# EasyEDA Pro project ProPrj_IP6829Test_2025-08-12.epro

# Schematic Schematic2
Board Name: IP6826; Create Date: 2025-07-03; Page Name: P1; Project Name: IP6829Test; Schematic Name: Schematic2; Update Date: 2025-07-26; Company: 嘉立创EDA; Page Size: A4; Version: V1.0
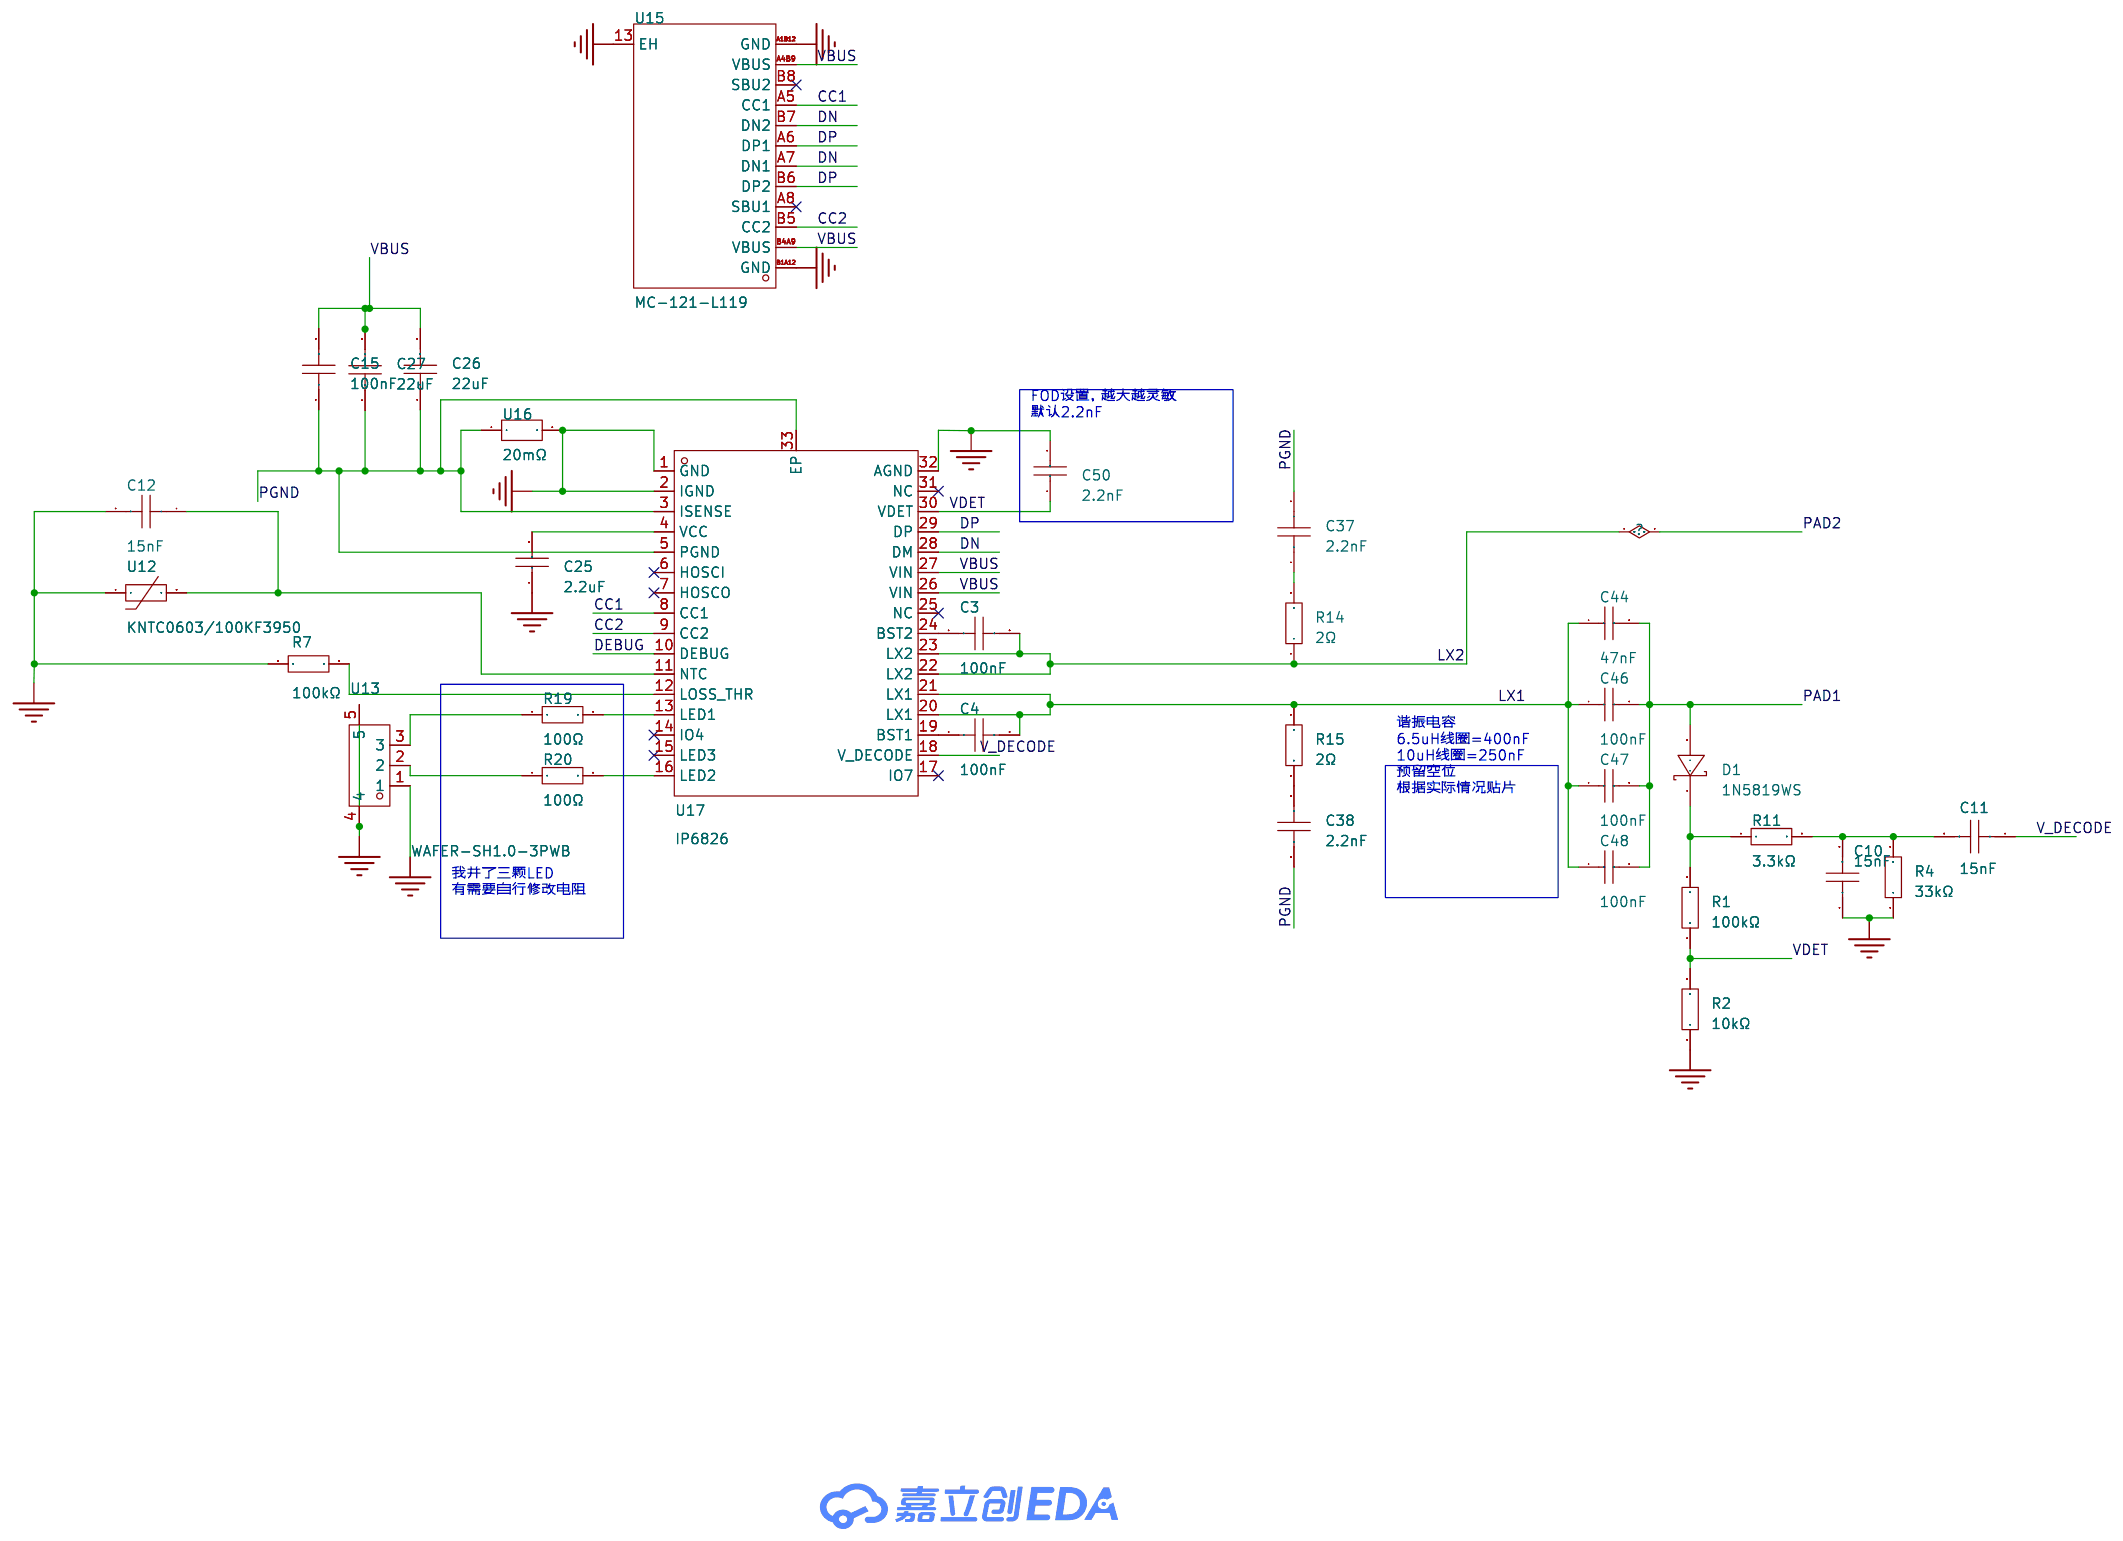
[diagram p0: schematic sheet]

## Parts
C3  100nF  [C0402]
C4  100nF  [C0402]
C10  15nF  [C0402]
C11  15nF  [C0402]
C12  15nF  [C0402]
C15  100nF  [C0603]
C25  2.2uF  [C0603]
C26  22uF  [C0805]
C27  22uF  [C0805]
C37  2.2nF  [C0402]
C38  2.2nF  [C0402]
C44  47nF  [C1206]
C46  100nF  [C1206]
C47  100nF  [C1206]
C48  100nF  [C1206]
C50  2.2nF  [C0603]
D1  1N5819WS  [SOD-323_L1.8-W1.3-LS2.5-RD]
R1  100kΩ  [R0402]
R2  10kΩ  [R0402]
R4  33kΩ  [R0402]
R7  100kΩ  [R0402]
R11  3.3kΩ  [R0402]
R14  2Ω  [R0402]
R15  2Ω  [R0402]
R19  100Ω  [R0402]
R20  100Ω  [R0402]
U12  KNTC0603/100KF3950  [R0603]
U13  WAFER-SH1.0-3PWB  [CONN-SMD_3P-P1.00_WAFER-SH1.0-3PWB]
U15  MC-121-L119  [USB-C-SMD_HANBO_MC-121-L119]
U16  20mΩ  [R1206]
U17  IP6826  [QFN-32_L5.0-W5.0-P0.50-BL-EP3.8]

## Library data of the parts
C3 C4 = CL05B104KB54PNC: 容值:100nF;精度:±10%;额定电压:50V;材质(温度系数):X7R;; LCSC Part Name: 100nF ±10% 50V; Supplier Part: C307331; Manufacturer: SAMSUNG(三星); Supplier Footprint: 0402; JLCPCB Part Class: 基础库; Datasheet: https://atta.szlcsc.com/upload/public/pdf/source/20160218/1457707763339.pdf; Supplier: LCSC; Tolerance: ±10%; Voltage Rated: 50V; Temperature Coefficient: X7R
C10-C12 = CC0402KRX7R9BB153: 容值:15nF;精度:±10%;额定电压:50V;材质(温度系数):X7R;; LCSC Part Name: 15nF ±10% 50V; Supplier Part: C114405; Manufacturer: YAGEO(国巨); Supplier Footprint: 0402; JLCPCB Part Class: 扩展库; Datasheet: https://atta.szlcsc.com/upload/public/pdf/source/20170919/C131031_1505787245477976978.pdf; Supplier: LCSC; Tolerance: ±10%; Voltage Rated: 50V; Temperature Coefficient: X7R
C15 = CC0603KRX7R9BB104: 容值:100nF;精度:±10%;额定电压:50V;温度系数:X7R;; LCSC Part Name: 100nF ±10% 50V; Supplier Part: C14663; Manufacturer: YAGEO(国巨); Supplier Footprint: 0603; JLCPCB Part Class: 基础库; Datasheet: https://atta.szlcsc.com/upload/public/pdf/source/20180910/C282072_33301C7F631E79921B82A8DAC6BCC5B3.pdf; Supplier: LCSC; Tolerance: ±10%; Voltage Rating: 50V; Temperature Coefficient: X7R
C25 = CL10A225KO8NNNC: 容值:2.2uF;精度:±10%;额定电压:16V;材质(温度系数):X5R;; LCSC Part Name: 2.2uF ±10% 16V; Supplier Part: C23630; Manufacturer: SAMSUNG(三星); Supplier Footprint: 0603; JLCPCB Part Class: 基础库; Datasheet: https://atta.szlcsc.com/upload/public/pdf/source/20160218/1457707763339.pdf; Supplier: LCSC; Tolerance: ±10%; Voltage Rated: 16V; Temperature Coefficient: X5R
C26 C27 = CL21A226MAQNNNE: 容值:22uF;精度:±20%;额定电压:25V;材质(温度系数):X5R;; LCSC Part Name: 22uF ±20% 25V; Supplier Part: C45783; Manufacturer: SAMSUNG(三星); Supplier Footprint: 0805; JLCPCB Part Class: 基础库; Datasheet: https://atta.szlcsc.com/upload/public/pdf/source/20160218/1457707763339.pdf; Supplier: LCSC; Tolerance: ±20%; Voltage Rated: 25V; Temperature Coefficient: X5R
C37 C38 = CC0402JRX7R9BB222: 容值:2.2nF;精度:±5%;额定电压:50V;材质(温度系数):X7R;; LCSC Part Name: 2.2nF ±5% 50V; Supplier Part: C513667; Manufacturer: YAGEO(国巨); Supplier Footprint: 0402; JLCPCB Part Class: 扩展库; Datasheet: https://atta.szlcsc.com/upload/public/pdf/source/20200415/C513667_43ACA5E3BCCDD816EC65E9B61132137F.pdf; Supplier: LCSC; Tolerance: ±5%; Voltage Rated: 50V; Temperature Coefficient: X7R
C44 = GRM31M5C1H473JA01L: 容值:47nF;精度:±5%;额定电压:50V;材质(温度系数):C0G;; LCSC Part Name: 47nF ±5% 50V; Supplier Part: C21812; Manufacturer: muRata(村田); Supplier Footprint: 1206; JLCPCB Part Class: 扩展库; Datasheet: https://atta.szlcsc.com/upload/public/pdf/source/20180228/C21812_15198055830211377594.pdf; Supplier: LCSC; Tolerance: ±5%; Voltage Rated: 50V; Temperature Coefficient: C0G
C46-C48 = GRM31C5C1H104JA01L: 容值:100nF;精度:±5%;额定电压:50V;材质(温度系数):C0G;; LCSC Part Name: 100nF ±5% 50V; Supplier Part: C97946; Manufacturer: muRata(村田); Supplier Footprint: 1206; JLCPCB Part Class: 扩展库; Datasheet: https://atta.szlcsc.com/upload/public/pdf/source/20180228/C97946_15198056954501377706.pdf; Supplier: LCSC; Tolerance: ±5%; Voltage Rated: 50V; Temperature Coefficient: C0G
C50 = 0603B222K500NT: 容值:2.2nF;精度:±10%;额定电压:50V;温度系数:X7R;; LCSC Part Name: 2.2nF ±10% 50V; Supplier Part: C1604; Manufacturer: FH(风华); Supplier Footprint: 0603; JLCPCB Part Class: 基础库; Datasheet: https://atta.szlcsc.com/upload/public/pdf/source/20200305/C486355_26A10D38EF8C2A5C37091D0039909270.pdf; Supplier: LCSC; Tolerance: ±10%; Voltage Rating: 50V; Temperature Coefficient: X7R
D1 = 1N5819WS_C191023: 正向压降(Vf):600mV@1A;直流反向耐压(Vr):40V;整流电流:1A;; LCSC Part Name: 电压:40V 电流:1A; Supplier Part: C191023; Manufacturer: Hottech(合科泰); Supplier Footprint: SOD-323; JLCPCB Part Class: 基础库; Datasheet: https://atta.szlcsc.com/upload/public/pdf/source/20220428/3CB86FD8D28D653594B4E35F9D5AEFD9.pdf; Supplier: LCSC; Forward Voltage (Vf@If): 600mV@1A; Reverse Voltage (Vr): 40V; Rectified Current: 1A
R1 R7 = 0402WGF1003TCE: 电阻类型:厚膜电阻;阻值:100kΩ;精度:±1%;功率:62.5mW;最大工作电压:50V;温度系数:±100ppm/℃;; LCSC Part Name: 100kΩ ±1% 62.5mW 厚膜电阻; Supplier Part: C25741; Manufacturer: UNI-ROYAL(厚声); Supplier Footprint: 0402; JLCPCB Part Class: 基础库; Datasheet: https://atta.szlcsc.com/upload/public/pdf/source/20200306/C422600_1E6D84923E4A46A82E41ADD87F860B5C.pdf; Supplier: LCSC; Type: 厚膜电阻; Tolerance: ±1%; Power(Watts): 62.5mW; Overload Voltage (Max): 50V; Temperature Coefficient: ±100ppm/℃; Operating Temperature Range: -55℃~+155℃
R2 = 0402WGF1002TCE: 电阻类型:厚膜电阻;阻值:10kΩ;精度:±1%;功率:62.5mW;最大工作电压:50V;温度系数:±100ppm/℃;; LCSC Part Name: 10kΩ ±1% 62.5mW 厚膜电阻; Supplier Part: C25744; Manufacturer: UNI-ROYAL(厚声); Supplier Footprint: 0402; JLCPCB Part Class: 基础库; Datasheet: https://atta.szlcsc.com/upload/public/pdf/source/20200306/C422600_1E6D84923E4A46A82E41ADD87F860B5C.pdf; Supplier: LCSC; Type: 厚膜电阻; Tolerance: ±1%; Power(Watts): 62.5mW; Overload Voltage (Max): 50V; Temperature Coefficient: ±100ppm/℃; Operating Temperature Range: -55℃~+155℃
R4 = 0402WGF3302TCE: 电阻类型:厚膜电阻;阻值:33kΩ;精度:±1%;功率:62.5mW;最大工作电压:50V;温度系数:±100ppm/℃;; LCSC Part Name: 33kΩ ±1% 62.5mW 厚膜电阻; Supplier Part: C25779; Manufacturer: UNI-ROYAL(厚声); Supplier Footprint: 0402; JLCPCB Part Class: 基础库; Datasheet: https://atta.szlcsc.com/upload/public/pdf/source/20200306/C422600_1E6D84923E4A46A82E41ADD87F860B5C.pdf; Supplier: LCSC; Type: 厚膜电阻; Tolerance: ±1%; Power(Watts): 62.5mW; Overload Voltage (Max): 50V; Temperature Coefficient: ±100ppm/℃; Operating Temperature Range: -55℃~+155℃
R11 = 0402WGF3301TCE: 电阻类型:厚膜电阻;阻值:3.3kΩ;精度:±1%;功率:62.5mW;工作电压:50V;温度系数:±100ppm/℃;; LCSC Part Name: 3.3kΩ ±1% 62.5mW 厚膜电阻; Supplier Part: C25890; Manufacturer: UNI-ROYAL(厚声); Supplier Footprint: 0402; JLCPCB Part Class: 基础库; Datasheet: https://atta.szlcsc.com/upload/public/pdf/source/20200306/C422600_1E6D84923E4A46A82E41ADD87F860B5C.pdf; Supplier: LCSC; Type: 厚膜电阻; Tolerance: ±1%; Power(Watts): 62.5mW; Voltage-Supply(Max): 50V; Temperature Coefficient: ±100ppm/℃; Operating Temperature: -55℃~+155℃
R14 R15 = 0402WGF200KTCE: 电阻类型:厚膜电阻;阻值:2Ω;精度:±1%;功率:62.5mW;最大工作电压:50V;温度系数:±200ppm/℃;; LCSC Part Name: 2Ω ±1% 62.5mW 厚膜电阻; Supplier Part: C270630; Manufacturer: UNI-ROYAL(厚声); Supplier Footprint: 0402; JLCPCB Part Class: 扩展库; Datasheet: https://atta.szlcsc.com/upload/public/pdf/source/20200306/C422600_1E6D84923E4A46A82E41ADD87F860B5C.pdf; Supplier: LCSC; Type: 厚膜电阻; Tolerance: ±1%; Power(Watts): 62.5mW; Overload Voltage (Max): 50V; Temperature Coefficient: ±200ppm/℃; Operating Temperature Range: -55℃~+155℃
R19 R20 = 0402WGF1000TCE: 电阻类型:厚膜电阻;阻值:100Ω;精度:±1%;功率:62.5mW;最大工作电压:50V;温度系数:±200ppm/℃;; LCSC Part Name: 100Ω ±1% 62.5mW 厚膜电阻; Supplier Part: C25076; Manufacturer: UNI-ROYAL(厚声); Supplier Footprint: 0402; JLCPCB Part Class: 基础库; Datasheet: https://atta.szlcsc.com/upload/public/pdf/source/20200306/C422600_1E6D84923E4A46A82E41ADD87F860B5C.pdf; Supplier: LCSC; Type: 厚膜电阻; Tolerance: ±1%; Power(Watts): 62.5mW; Overload Voltage (Max): 50V; Temperature Coefficient: ±200ppm/℃; Operating Temperature Range: -55℃~+155℃
U12 = KNTC0603/100KF3950: 阻值:100kΩ;B值(25℃/50℃):3950K;功率:100mW;B值精度:±1%;最大稳态电流(25℃):100uA;; Supplier Part: C2892545; Manufacturer: KUU; Supplier Footprint: 0603; JLCPCB Part Class: 扩展库; Datasheet: https://atta.szlcsc.com/upload/public/pdf/source/20210908/FAA8C255963A129B4BD305DA7EAE142A.pdf; Supplier: LCSC; Resistance @ 25℃: 100kΩ; B Constant (25℃/50℃): 3950K; B Constant (25℃/85℃): 4010K; Power(Watts): 100mW; B Constant Tolerance: ±1%; Steady State Current (Max): 100uA; Operating Temperature: -40℃~+125℃
U13 = WAFER-SH1.0-3PWB: 插针结构:1x3P;间距:1mm;安装方式:卧贴;参考系列:SH;总PIN数:3P;排数:1;每排PIN数:3;行距:-;额定电流:1A;触头材质:黄铜;触头镀层:-;工作温度:-25℃~+85℃;; LCSC Part Name: 1x3P 间距:1mm 卧贴 系列:SH; Supplier Part: C3029342; Manufacturer: XUNPU(讯普); Supplier Footprint: SMD,P=1mm,卧贴; JLCPCB Part Class: 扩展库; Datasheet: https://atta.szlcsc.com/upload/public/pdf/source/20220527/1879B8210BD3B2006BCEAC1A40D397B6.pdf; Supplier: LCSC; Pins Structure: 1x3P; Pitch: 1mm; Mounting Type: 卧贴; Reference Series: SH; Number of Pins: 3P; Number of Rows: 1; Number of PINs Per Row: 3; Current Rating: 1A; Contact Material: 黄铜; Operating Temperature: -25℃~+85℃; Voltage Rating: 50V; Plastic Material: LCP; Supplementary Features: 辅助焊脚; Color: 米色; Z-Height of the Board: 3.15mm; X-Length of Bottom Edge on Board (Spacing Line): 5.35mm; Y-Width of Bottom Edge on Board: 5.05mm
U15 = MC-121-L119: 连接器类型:Type-C;标准:USB 3.1;公母:母;端口数量:1;触点数量:16P;安装方式:卧贴;额定电流 - 电源:5A;工作温度范围:-40℃~+85℃;焊接温度(最大值):260℃;; LCSC Part Name: Type-C 母 卧贴; Supplier Part: C6332278; Manufacturer: HANBO(汉博); Supplier Footprint: SMD; JLCPCB Part Class: 扩展库; Datasheet: https://atta.szlcsc.com/upload/public/pdf/source/20230512/44D8239F2DF29F16A3D0D3C05B6EA46D.pdf; Supplier: LCSC; Connector Type: Type-C; Standard: USB 3.1; Gender: 母; Number of Ports: 1; Number of Contacts: 16P; Mounting Style: 卧贴; Current Rating - Power (Max): 5A; Operating Temperature Range: -40℃~+85℃; Soldering Temperature(Max): 260℃
U16 = FRM121WFR020TM: 电阻类型:采样电阻;阻值:20mΩ;精度:±1%;功率:1W;温度系数:±50ppm/℃;; LCSC Part Name: 20mΩ ±1% 1W 合金电阻; Supplier Part: C7420010; Manufacturer: FOJAN(富捷); Supplier Footprint: 1206; JLCPCB Part Class: 扩展库; Datasheet: https://atta.szlcsc.com/upload/public/pdf/source/20240709/7FCE84187288C94C67B1004F90EDDF14.pdf; Supplier: LCSC; Type: 采样电阻; Tolerance: ±1%; Power(Watts): 1W; Temperature Coefficient: ±50ppm/℃
U17 = IP6826_C2921390: 无线充驱动芯片 。这个料是没有烧录固件的，白片。; LCSC Part Name: 集成15W无线充电发射器SOC 支持PD输入 停产; Supplier Part: C2921390; Manufacturer: INJOINIC(英集芯); Supplier Footprint: QFN-32-EP(5x5); JLCPCB Part Class: 扩展库; Datasheet: https://atta.szlcsc.com/upload/public/pdf/source/20211129/7DF870B96D3DBFA5E53D39AE478269E8.pdf; Supplier: LCSC

## Nets
GND: C10.1 C12.2 C25.1 C50.2 R2.1 R4.1 R7.2 U12.1 U13.1 U13.4 U13.5 U15.13(EH) U15.A1B12(GND) U15.B1A12(GND) U16.2 U17.1(GND) U17.2(IGND) U17.32(AGND)
PGND: C15.1 C26.1 C37.2 C38.2 U16.1 U17.3(ISENSE) U17.5(PGND) U17.33(EP)
VBUS: C15.2 C26.2 U15.A4B9(VBUS) U15.B4A9(VBUS) U17.26(VIN) U17.27(VIN)
CC1: U15.A5(CC1) U17.8(CC1)
CC2: U15.B5(CC2) U17.9(CC2)
DEBUG: U17.10(DEBUG)
DN: U15.A7(DN1) U15.B7(DN2) U17.28(DM)
DP: U15.A6(DP1) U15.B6(DP2) U17.29(DP)
LX1: C4.2 C44.1 C46.1 C47.1 C48.1 R15.1 U17.20(LX1) U17.21(LX1)
LX2: C3.2 R14.1 U17.22(LX2) U17.23(LX2)
PAD1: C44.2 C46.2 C47.2 C48.2 D1.2(A)
V_DECODE: C11.1 U17.18(V_DECODE)
VDET: C50.1 R1.1 R2.2 U17.30(VDET)
$1N1611: C25.2 U17.4(VCC)
$1N1640: D1.1(K) R1.2 R11.1
$1N1645: C10.2 C11.2 R4.2 R11.2
$1N1648: R19.2 U17.13(LED1)
$1N1649: R20.2 U17.16(LED2)
$1N1650: R19.1 U13.3
$1N1651: R20.1 U13.2
$1N1655: R7.1 U17.12(LOSS_THR)
$1N1658: C12.1 U12.2 U17.11(NTC)
$1N6577: C37.1 R14.2
$1N6953: C38.1 R15.2
$1N16061: C3.1 U17.24(BST2)
$1N16063: C4.1 U17.19(BST1)

Not connected (* = marked no-connect by the designer): C27 1 2; U15 A8(SBU1)* B8(SBU2)*; U17 6(HOSCI)* 7(HOSCO)* 14(IO4)* 15(LED3)* 17(IO7)* 25(NC)* 31(NC)*

## Notes on the sheet
- FOD设置，越大越灵敏
  默认2.2nF
- 谐振电容
  6.5uH线圈=400nF
  10uH线圈=250nF
  预留空位
  根据实际情况贴片
- 我并了三颗LED
  有需要自行修改电阻

# Schematic Schematic3
Board Name: Board3; Create Date: 2025-07-17; Page Name: P1; Project Name: IP6829Test; Schematic Name: Schematic3; Update Date: 2025-07-18; Company: 嘉立创EDA; Page Size: A4; Version: V1.0
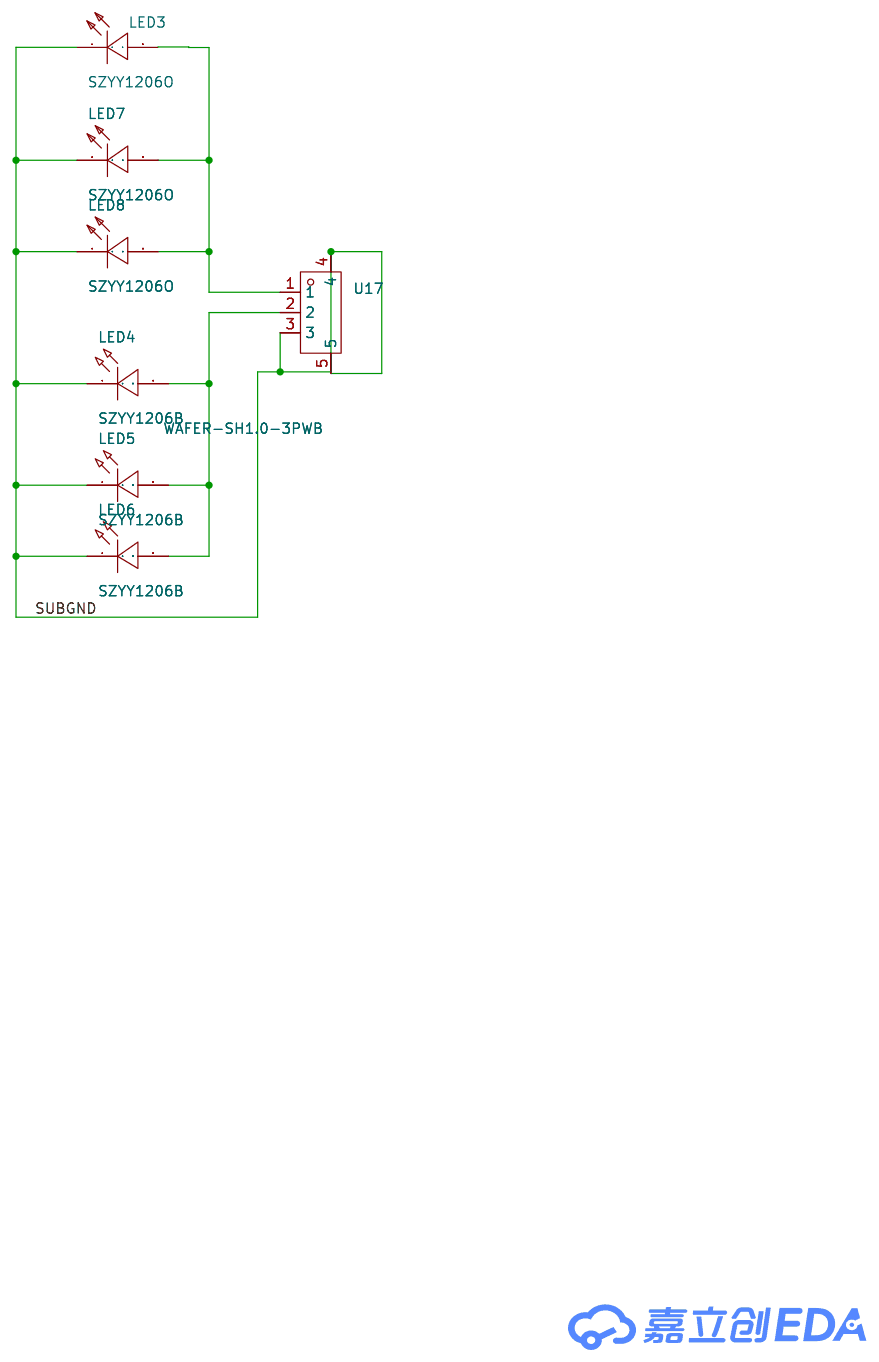
[diagram p1: schematic sheet]

## Parts
LED3  SZYY1206O  [LED1206-RD_ORANGE]
LED4  SZYY1206B  [LED1206-RD_BLUE]
LED5  SZYY1206B  [LED1206-RD_BLUE]
LED6  SZYY1206B  [LED1206-RD_BLUE]
LED7  SZYY1206O  [LED1206-RD_ORANGE]
LED8  SZYY1206O  [LED1206-RD_ORANGE]
U17  WAFER-SH1.0-3PWB  [CONN-SMD_3P-P1.00_WAFER-SH1.0-3PWB]

## Library data of the parts
LED3 LED7 LED8 = SZYY1206O: 发光颜色:橙色;功率:40mW;正向电流:10mA;主波长:598nm~608nm;二极管配置:-;透镜颜色:无色透明透镜;色温:-;发光角度:120°;载带方式:-;工作温度:-40℃~+85℃;; LCSC Part Name: 橙灯; Supplier Part: C434444; Manufacturer: yongyu(永裕光电); Supplier Footprint: 1206; JLCPCB Part Class: 扩展库; Datasheet: https://atta.szlcsc.com/upload/public/pdf/source/20200628/C434444_6ECB98FD1A7DFA4E2730C4AB27077783.pdf; Supplier: LCSC; Emitted Color: 橙色; Power Dissipation: 40mW; Forward Current: 10mA; Dominant Wavelength: 598nm~608nm; Peak Wavelength: 612nm; Lens Color: 无色透明透镜; Viewing Angle: 120°; Operating Temperature: -40℃~+85℃
LED4-LED6 = SZYY1206B: 发光颜色:蓝色;功率:100mW;正向电流:5mA;主波长:460nm~475nm;二极管配置:-;透镜颜色:无色透明透镜;色温:-;发光角度:120°;载带方式:-;工作温度:-40℃~+85℃;; LCSC Part Name: 蓝灯; Supplier Part: C434440; Manufacturer: yongyu(永裕光电); Supplier Footprint: 1206; JLCPCB Part Class: 扩展库; Datasheet: https://atta.szlcsc.com/upload/public/pdf/source/20200628/C434440_4695B106742D2A5A4116465A96970157.pdf; Supplier: LCSC; Emitted Color: 蓝色; Power Dissipation: 100mW; Forward Current: 5mA; Dominant Wavelength: 460nm~475nm; Peak Wavelength: 469nm; Lens Color: 无色透明透镜; Viewing Angle: 120°; Operating Temperature: -40℃~+85℃
U17 = WAFER-SH1.0-3PWB: 插针结构:1x3P;间距:1mm;安装方式:卧贴;参考系列:SH;总PIN数:3P;排数:1;每排PIN数:3;行距:-;额定电流:1A;触头材质:黄铜;触头镀层:-;工作温度:-25℃~+85℃;; LCSC Part Name: 1x3P 间距:1mm 卧贴 系列:SH; Supplier Part: C3029342; Manufacturer: XUNPU(讯普); Supplier Footprint: SMD,P=1mm,卧贴; JLCPCB Part Class: 扩展库; Datasheet: https://atta.szlcsc.com/upload/public/pdf/source/20220527/1879B8210BD3B2006BCEAC1A40D397B6.pdf; Supplier: LCSC; Pins Structure: 1x3P; Pitch: 1mm; Mounting Type: 卧贴; Reference Series: SH; Number of Pins: 3P; Number of Rows: 1; Number of PINs Per Row: 3; Current Rating: 1A; Contact Material: 黄铜; Operating Temperature: -25℃~+85℃; Voltage Rating: 50V; Plastic Material: LCP; Supplementary Features: 辅助焊脚; Color: 米色; Z-Height of the Board: 3.15mm; X-Length of Bottom Edge on Board (Spacing Line): 5.35mm; Y-Width of Bottom Edge on Board: 5.05mm

## Nets
SUBGND: LED4.1 LED5.1 LED6.1 LED7.1(K) LED8.1(K) U17.3 U17.4 U17.5
$1N373: LED4.2 LED5.2 LED6.2 U17.2
Net-(LED7-2): LED7.2(A) LED8.2(A) U17.1

Not connected (* = marked no-connect by the designer): LED3 1(K) 2(A)

# Board PCB18
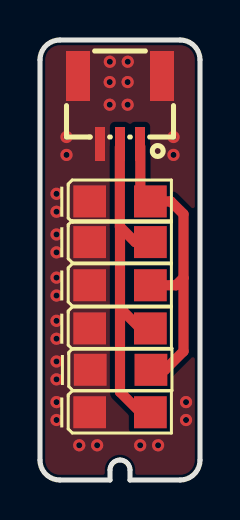
[diagram p2: board, top side]
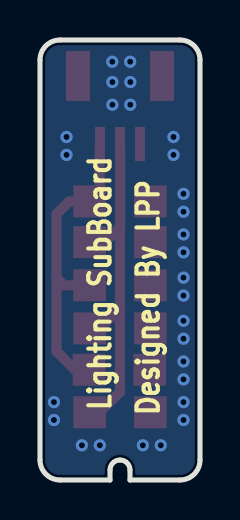
[diagram p3: board, bottom side, seen from below]

Outline 8 x 22 mm; copper layers: Top Layer, Bottom Layer. Coordinates in mm from the lower left corner of the outline.
Outline path: 0,21 arc(0.29,21.71) 1,22 7,22 arc(7.71,21.71) 8,21 8,1 arc(7.71,0.29) 7,0 4.5,0 4.5,0.5 arc(4.35,0.85) 4,1 arc(3.65,0.85) 3.5,0.5 3.5,0 1,0 arc(0.29,0.29) 0,1 0,21
Stack: Top Layer 0.035mm / Dielectric1 1.51mm FR4 er 4.5 / Bottom Layer 0.035mm

## Design rules (mm)
template: 自定义配置
spacing copperThickness1oz (default): track to track 0.102, other pairs 0.152 to 0.3
spacing copperThickness2oz: track to track 0.203, other pairs 0.152 to 0.3
track width copperThickness1oz (default): min 0.127, default 0.254, max 2.54
track width copperThickness2oz: min 0.203, default 0.254, max 2.54
differential pair differentialPair (default): width min 0.127, default 0.254, max 2.54; gap min 0.152, default 0.152
via viaSize (default): diameter min 0.5, default 0.61, max 10; hole min 0.3, default 0.305, max 6.3

## Placement (name value [footprint] x y rotation side)
LED3  SZYY1206O  [LED1206-RD_ORANGE]  4 13.93 0 top
LED4  SZYY1206B  [LED1206-RD_BLUE]  4 11.9 0 top
LED5  SZYY1206B  [LED1206-RD_BLUE]  4 7.58 0 top
LED6  SZYY1206B  [LED1206-RD_BLUE]  4 3.39 0 top
LED7  SZYY1206O  [LED1206-RD_ORANGE]  4.03 5.51 0 top
LED8  SZYY1206O  [LED1206-RD_ORANGE]  4 9.74 0 top
U17  WAFER-SH1.0-3PWB  [CONN-SMD_3P-P1.00_WAFER-SH1.0-3PWB]  4 18.5 180 top

## Footprints (pads in the part's own frame, mm; a bottom-side part is the same pattern mirrored in y, then rotated)
CONN-SMD_3P-P1.00_WAFER-SH1.0-3PWB
  rect 0.5x1.7 smd: 1(-1,1.7) 2(0,1.7) 3(1,1.7)
  rect 1.2x2.5 smd: 4(-2.1,-1.7) 5(2.1,-1.7)
LED1206-RD_BLUE
  rect 1.635x1.6 smd: 1(-1.518,0) 2(1.518,0)
LED1206-RD_ORANGE
  rect 1.635x1.6 smd: 1(-1.518,0) 2(1.518,0)

## Nets
SUBGND: LED3.1 LED4.1 LED5.1 LED6.1 LED7.1 LED8.1 U17.3 U17.4 U17.5
$1N370: LED3.2 LED7.2 LED8.2 U17.1
$1N373: LED4.2 LED5.2 LED6.2 U17.2

## Via types
v1: diameter 0.61, hole 0.305, Top Layer to Bottom Layer, 28 vias

## Routing (per net, layer and track width the routed paths; a pad name or vN(x,y) marks a point on that pad's centre or on a via; arc(x,y) is an arc through that point)
SUBGND:
  vias: v1(0.82,14.31) v1(0.82,13.41) v1(0.82,12.28) v1(0.82,11.38) v1(0.82,10.12) v1(0.82,9.22) v1(0.82,7.96) v1(0.82,7.06) v1(0.82,5.93) v1(0.82,5.03) v1(0.82,3.89) v1(0.82,3) v1(1.32,17.15) v1(1.32,16.25) v1(1.96,1.74) v1(2.86,1.74) v1(3.49,20.91) v1(3.49,19.9) v1(3.49,18.76) v1(4.39,20.91) v1(4.38,19.9) v1(4.38,18.76) v1(5.01,1.74) v1(5.91,1.74) v1(6.68,17.15) v1(6.68,16.25) v1(7.3,3.89) v1(7.3,3)
$1N370: length 15.8
  Top Layer w0.508: 5.67,13.77 5.02,14.42 5.02,16.67 ; LED8.2 6.8,9.74 7.18,10.11 ; LED3.2 6.54,13.93 7.18,13.29 7.18,10.11 ; LED7.2 6.25,5.51 7.18,6.44 7.18,10.11
$1N373: length 18.4
  Top Layer w0.508: 4,8.59 4,12.66 4.76,11.9 LED4.2 ; 4,8.59 4,4.4 5.27,3.14 LED6.2 ; 4,8.59 5.27,7.33 LED5.2 ; 3.99,16.64 3.99,12.67

## Copper pours and planes (outline as drawn; the poured copper is in the pictures)
SUBGND on Top Layer: -2.48,23.83 9.33,23.83 9.33,-0.68 -2.48,-0.68
SUBGND on Bottom Layer: -0.7,22.69 11.49,22.69 11.49,-2.58 -0.7,-2.58

## Text on the board
Bottom Silkscreen Layer: Lighting SubBoard | Designed By LPP

# Board PCB1_1
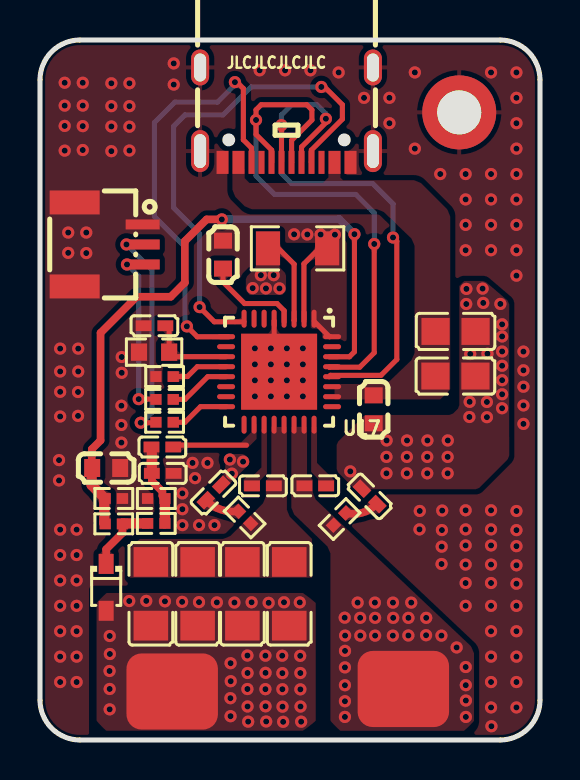
[diagram p4: board, top side]
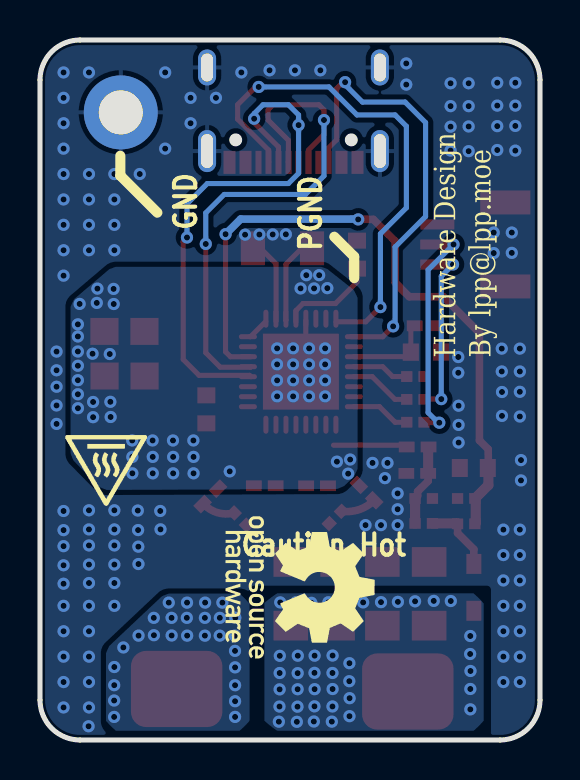
[diagram p5: board, bottom side, seen from below]

Outline 25 x 35 mm; copper layers: Top Layer, Bottom Layer. Coordinates in mm from the lower left corner of the outline.
Outline path: 0,33 0,2 arc(0.59,0.59) 2,0 23,0 arc(24.41,0.59) 25,2 25,33 arc(24.41,34.41) 23,35 2,35 arc(0.59,34.41) 0,33
Stack: Top Layer 0.035mm / Dielectric1 1.11mm FR4 er 4.5 / Bottom Layer 0.035mm

## Design rules (mm)
net DP: DP1
net DN: DP1
template: 自定义配置
spacing copperThickness1oz (default): track to track 0.102, other pairs 0.152 to 0.3
spacing copperThickness2oz: track to track 0.203, other pairs 0.152 to 0.3
track width copperThickness1oz (default): min 0.127, default 0.254, max 2.54
track width copperThickness2oz: min 0.203, default 0.254, max 2.54
differential pair differentialPair (default): width min 0.127, default 0.254, max 2.54; gap min 0.152, default 0.152
via viaSize (default): diameter min 0.5, default 0.61, max 10; hole min 0.3, default 0.305, max 6.3

## Placement (name value [footprint] x y rotation side)
C3  100nF  [C0402]  13.76 12.71 180 top
C4  100nF  [C0402]  11.15 12.71 0 top
C10  15nF  [C0402]  6.14 13.33 180 top
C11  15nF  [C0402]  6.12 14.65 180 top
C12  15nF  [C0402]  5.72 20.71 180 top
C15  100nF  [C0603]  16.69 16.53 90 top
C25  2.2uF  [C0603]  9.15 24.27 270 top
C26  22uF  [C0805]  20.78 20.43 180 top
C27  22uF  [C0805]  20.77 18.2 180 top
C37  2.2nF  [C0402]  16.48 12.18 135 top
C38  2.2nF  [C0402]  8.68 12.37 45 top
C44  47nF  [C1206]  7.88 7.31 270 top
C46  100nF  [C1206]  12.46 7.31 270 top
C47  100nF  [C1206]  10.12 7.31 270 top
C48  100nF  [C1206]  5.54 7.31 270 top
C50  2.2nF  [C0603]  3.31 13.6 0 top
D1  1N5819WS  [SOD-323_L1.8-W1.3-LS2.5-RD]  3.31 7.63 270 top
NOREF  -  [Pad_e2145]  6.61 2.42 90 top
NOREF#2  -  [Pad_e298]  20.96 31.38 0 top
NOREF#3  -  [Pad_e2143]  18.17 2.55 270 top
R1  100kΩ  [R0402]  3.69 10.81 0 top
R2  10kΩ  [R0402]  3.69 12.08 180 top
R4  33kΩ  [R0402]  5.81 12.08 0 top
R7  100kΩ  [R0402]  6.23 18.17 180 top
R11  3.3kΩ  [R0402]  5.81 10.83 0 top
R14  2Ω  [R0402]  14.98 11.05 45 top
R15  2Ω  [R0402]  10.23 11.13 135 top
R19  100Ω  [R0402]  6.23 17.03 0 top
R20  100Ω  [R0402]  6.23 15.89 0 top
U12  KNTC0603/100KF3950  [R0603]  5.7 19.39 0 top
U13  WAFER-SH1.0-3PWB  [CONN-SMD_3P-P1.00_WAFER-SH1.0-3PWB]  3.44 24.78 270 top
U15  MC-121-L119  [USB-C-SMD_HANBO_MC-121-L119]  12.33 31.25 180 top
U16  20mΩ  [R1206]  12.88 24.58 0 top
U17  IP6826  [QFN-32_L5.0-W5.0-P0.50-BL-EP3.8]  11.95 18.42 180 top

## Footprints (pads in the part's own frame, mm; a bottom-side part is the same pattern mirrored in y, then rotated)
C0402
  rect 0.79x0.54 smd: 1(-0.545,0) 2(0.545,0)
C0603
  rect 0.8x0.9 smd: 1(-0.7,0) 2(0.7,0)
C0805
  rect 1.41x1.35 smd: 1(-1,0) 2(1,0)
C1206
  rect 1.485x1.728 smd: 1(-1.593,0) 2(1.593,0)
CONN-SMD_3P-P1.00_WAFER-SH1.0-3PWB
  rect 0.5x1.7 smd: 1(-1,1.7) 2(0,1.7) 3(1,1.7)
  rect 1.2x2.5 smd: 4(-2.1,-1.7) 5(2.1,-1.7)
Pad_e298
  round 3.7 hole 2.2: 1(0,0)
Pad_e2143
  rrect 3.81x4.572 smd: 1(0,0)
Pad_e2145
  rrect 3.81x4.572 smd: 1(0,0)
QFN-32_L5.0-W5.0-P0.50-BL-EP3.8
  oval 0.25x0.9 smd: 1(-1.75,-2.65) 2(-1.25,-2.65) 3(-0.749,-2.65) 4(-0.249,-2.65) 5(0.249,-2.65) 6(0.75,-2.65) 7(1.25,-2.65) 8(1.75,-2.65) 17(1.75,2.65) 18(1.25,2.65) 19(0.75,2.65) 20(0.249,2.65) 21(-0.249,2.65) 22(-0.749,2.65) 23(-1.25,2.65) 24(-1.75,2.65)
  oval 0.9x0.25 smd: 9(2.65,-1.75) 10(2.65,-1.25) 11(2.65,-0.75) 12(2.65,-0.249) 13(2.65,0.249) 14(2.65,0.749) 15(2.65,1.25) 16(2.65,1.75) 25(-2.65,1.75) 26(-2.65,1.25) 27(-2.65,0.749) 28(-2.65,0.249) 29(-2.65,-0.249) 30(-2.65,-0.75) 31(-2.65,-1.25) 32(-2.65,-1.75)
  rect 3.8x3.8 smd: 33(0,0)
R0402
  rect 0.566x0.54 smd: 1(-0.433,0) 2(0.433,0)
R0603
  rect 0.806x0.864 smd: 1(-0.753,0) 2(0.753,0)
R1206
  rect 1.208x1.701 smd: 1(-1.479,0) 2(1.479,0)
SOD-323_L1.8-W1.3-LS2.5-RD
  rect 1x0.75 smd: 1(-1.173,0) 2(1.173,0)
USB-C-SMD_HANBO_MC-121-L119
  oval 0.9x2.1 hole 0.6x1.7: 13(-4.32,1.808) 13(4.32,1.808)
  oval 0.9x1.8 hole 0.6x1.4: 13(-4.32,-2.373) 13(4.32,-2.373)
  rect 0.6x1.15 smd: A1B12(-3.2,2.373) A4B9(-2.4,2.373) B1A12(3.2,2.373) B4A9(2.4,2.373)
  rect 0.3x1.15 smd: A5(-1.25,2.373) A6(-0.25,2.373) A7(0.25,2.373) A8(1.25,2.373) B5(1.75,2.373) B6(0.75,2.373) B7(-0.75,2.373) B8(-1.75,2.373)

## Nets
As in the schematic, except:
GND: C10.1 C12.2 C25.1 C50.2 NOREF#2.1 R2.1 R4.1 R7.2 U12.1 U13.1 U13.4 U13.5 U15.13 U15.A1B12 U15.B1A12 U16.2 U17.1 U17.2 U17.32
PGND: C15.1 C26.1 C27.1 C37.2 C38.2 U16.1 U17.3 U17.5 U17.33
VBUS: C15.2 C26.2 C27.2 U15.A4B9 U15.B4A9 U17.26 U17.27
LX2: C3.2 NOREF#3.1 R14.1 U17.22 U17.23
PAD1: C44.2 C46.2 C47.2 C48.2 D1.2 NOREF.1

Pads without a net: U15 A8 B8; U17 6 7 14 15 17 25 31

## Via types
v1: diameter 0.61, hole 0.305, Top Layer to Bottom Layer, 266 vias

## Routing (per net, layer and track width the routed paths; a pad name or vN(x,y) marks a point on that pad's centre or on a via; arc(x,y) is an arc through that point)
GND: length 5.3
  Top Layer w0.254: 14.5,20.17 14.47,20.17 13.71,20.93 ; 14.27,24.52 13.91,24.52 13.2,23.81 13.2,20.95
  vias: v1(0.95,14) v1(0.95,12.98) v1(1.01,19.57) v1(1.01,18.43) v1(1.01,17.41) v1(1.01,16.17) v1(1.01,10.52) v1(1.01,9.25) v1(1.01,7.98) v1(1.01,6.71) v1(1.01,5.44) v1(1.01,4.17) v1(1.01,2.9) v1(1.23,32.86) v1(1.23,31.72) v1(1.23,30.7) v1(1.23,29.47) v1(1.41,25.37) v1(1.41,24.36) v1(1.83,10.52) v1(1.83,9.25) v1(1.83,7.98) v1(1.83,6.71) v1(1.83,5.44) v1(1.83,4.17) v1(1.83,2.9) v1(1.91,19.57) v1(1.91,18.43) v1(1.9,17.4) v1(1.9,16.21) v1(2.14,32.86) v1(2.14,31.72) v1(2.14,30.69) v1(2.14,29.5) v1(2.31,25.37) v1(2.31,24.35) v1(3.57,32.84) v1(3.57,31.69) v1(3.57,30.68) v1(3.57,29.44) v1(4.07,16.71) v1(4.07,15.75) v1(4.07,14.87) v1(4.09,19.15) v1(4.09,18.36) v1(4.47,32.84) v1(4.47,31.69) v1(4.47,30.67) v1(4.47,29.47) v1(6.69,33.83) v1(6.69,32.77) v1(7.12,12.33) v1(7.12,11.54) v1(7.12,10.74) v1(7.63,13.85) v1(7.75,13.09) v1(7.95,10.74) v1(8.37,13.85) v1(8.72,10.74) v1(10.98,33.48) v1(12.25,33.48) v1(12.71,25.28) v1(13.37,25.28) v1(13.52,33.48) v1(14.03,25.27) v1(14.75,25.27) v1(14.93,33.38) v1(16.2,32.11) v1(17.47,32.11) v1(17.47,30.84) v1(18.74,33.38) v1(18.74,29.57) v1(18.97,10.53) v1(18.99,11.45) v1(20.01,28.3) v1(20.08,8.8) v1(20.11,11.47) v1(20.1,10.5) v1(20.08,9.67) v1(21.28,28.3) v1(21.28,27.03) v1(21.28,25.76) v1(21.28,24.49) v1(21.28,11.49) v1(21.28,10.53) v1(21.28,9.73) v1(21.28,8.77) v1(21.28,7.85) v1(21.28,6.71) v1(22.55,33.38) v1(22.55,28.3) v1(22.55,27.03) v1(22.55,25.76) v1(22.55,24.49) v1(22.55,11.49) v1(22.55,10.53) v1(22.55,9.73) v1(22.55,8.77) v1(22.55,7.85) v1(22.55,6.71) v1(22.55,5.44) v1(22.55,4.17) v1(22.55,2.9) v1(22.55,1.63) v1(22.57,0.69) v1(23.82,33.38) v1(23.82,32.11) v1(23.82,30.84) v1(23.82,29.57) v1(23.82,28.3) v1(23.82,27.03) v1(23.82,25.76) v1(23.82,24.49) v1(23.82,23.22) v1(23.82,11.45) v1(23.82,10.49) v1(23.82,9.69) v1(23.82,8.74) v1(23.82,7.81) v1(23.82,6.71) v1(23.82,5.44) v1(23.82,4.17) v1(23.82,2.9) v1(23.82,1.63) v1(24.17,19.42) v1(24.17,18.49) v1(24.17,17.66) v1(24.17,16.73) v1(24.17,15.81)
PGND: length 5.6
  Top Layer w0.254: 11.71,20.97 11.71,19.82 ; 12.7,20.99 12.71,20.99 12.71,23.79 11.89,24.6 11.41,24.6
  vias: v1(9.49,14.02) v1(9.59,13.32) v1(10.15,13.92) v1(10.63,22.59) v1(10.74,19.58) v1(10.74,18.78) v1(10.74,17.98) v1(10.74,17.18) v1(11.04,23.24) v1(11.3,22.58) v1(11.54,19.58) v1(11.54,18.78) v1(11.54,17.98) v1(11.54,17.18) v1(11.69,23.24) v1(11.97,22.58) v1(12.34,19.58) v1(12.34,18.78) v1(12.34,17.98) v1(12.34,17.18) v1(13.14,19.58) v1(13.14,18.78) v1(13.14,17.98) v1(13.14,17.18) v1(15.51,13.43) v1(17.33,14.98) v1(17.32,14.16) v1(17.32,13.33) v1(18.35,14.98) v1(18.34,14.16) v1(18.34,13.33) v1(19.37,14.98) v1(19.36,14.16) v1(19.36,13.33) v1(20.38,14.16) v1(20.38,13.33) v1(20.39,14.98) v1(21.32,22.55) v1(21.31,21.8) v1(21.48,16.91) v1(21.47,16.15) v1(21.51,19.3) v1(22.13,22.57) v1(22.16,21.85) v1(22.37,19.31) v1(22.35,16.9) v1(22.35,16.14) v1(23.02,21.8) v1(23.11,20.78) v1(23.11,20.18) v1(23.11,19.43) v1(23.11,18.71) v1(23.11,17.99) v1(23.11,17.29) v1(23.1,16.59)
CC1: length 25.3
  Top Layer w0.254: U15.A5 13.57,28.89 13.57,29.49 15.12,31.04 15.12,31.76 14.23,32.65 v1(14.07,32.65) ; v1(7.98,21.65) 8.71,20.91 10.2,20.91
  Bottom Layer w0.254: v1(14.07,32.65) 10.55,32.65 9.15,31.25 7.25,31.25 6.68,30.69 6.68,26.61 7.98,25.31 v1(7.98,21.65)
CC2: length 22.5
  Top Layer w0.254: v1(9.75,32.89) 9.85,32.89 10.17,32.58 10.17,30.01 10.58,29.6 U15.B5 ; 9.45,20.16 7.86,20.16 v1(7.34,20.68)
  Bottom Layer w0.254: v1(7.34,20.68) 7.25,20.78 7.25,24.65 5.72,26.17 5.72,30.87 6.75,31.9 8.88,31.9 9.75,32.77 v1(9.75,32.89)
DN: length 28.2
  Top Layer w0.254: v1(14.29,31.06) 14.29,30.87 13.08,29.65 U15.B7 ; 14.46,18.16 14.53,18.23 17.05,18.23 17.84,19.03 17.84,24.94 v1(17.65,25.13) ; v1(12.07,30.75) 12.08,30.74 U15.A7
  Bottom Layer w0.254: v1(14.29,31.06) 14.29,31.32 13.85,31.76 12.58,31.76 12.07,31.25 v1(12.07,30.75) 12.07,28.33 12.58,27.82 16.63,27.82 17.65,26.81 v1(17.65,25.13)
DP: length 28
  Top Layer w0.254: U15.A6 12.58,28.89 12.58,29.98 13.6,31 13.6,31.51 13.34,31.76 11.06,31.76 10.8,31.51 v1(10.8,31) 10.8,30.27 11.58,29.49 11.58,28.89 U15.B6 ; v1(16.71,24.8) 16.71,19.36 15.99,18.64 14.47,18.64 14.45,18.66
  Bottom Layer w0.254: v1(16.71,24.8) 16.71,26.36 15.79,27.28 11.73,27.28 10.8,28.21 v1(10.8,31)
LX2:
  vias: v1(15.23,6.12) v1(15.26,5.22) v1(15.25,4.46) v1(15.25,3.63) v1(15.25,2.74) v1(15.25,1.94) v1(15.25,1.15) v1(15.88,6.87) v1(16.01,6.11) v1(16.02,5.22) v1(16.75,6.87) v1(16.76,6.11) v1(16.76,5.22) v1(17.65,6.87) v1(17.66,6.11) v1(17.64,5.22) v1(18.42,6.11) v1(18.42,5.23) v1(18.56,6.87) v1(19.31,6.11) v1(19.3,5.24) v1(20.07,5.22) v1(20.83,4.63) v1(21.29,3.65) v1(21.29,2.74) v1(21.29,1.97) v1(21.29,1.15)
PAD1:
  vias: v1(3.48,3.45) v1(3.48,2.55) v1(3.48,1.53) v1(3.49,5.2) v1(3.49,4.3) v1(4.46,6.95) v1(5.31,6.96) v1(6.25,6.93) v1(7.11,6.91) v1(7.95,6.89) v1(8.84,6.88) v1(9.53,3.84) v1(9.54,2.94) v1(9.52,2.09) v1(9.53,1.19) v1(9.72,6.87) v1(10.37,4.22) v1(10.38,3.35) v1(10.37,2.55) v1(10.38,1.68) v1(10.41,0.92) v1(10.58,6.89) v1(11.27,4.22) v1(11.28,3.36) v1(11.27,2.54) v1(11.28,1.68) v1(11.31,0.92) v1(11.43,6.86) v1(12.11,4.21) v1(12.12,3.34) v1(12.12,2.54) v1(12.13,1.67) v1(12.16,0.91) v1(12.2,6.89) v1(12.99,6.88) v1(13.01,4.21) v1(13.02,3.35) v1(13.02,2.53) v1(13.03,1.67) v1(13.06,0.92)
V_DECODE: length 3.7
  Top Layer w0.254: C11.1 6.75,14.74 10.32,14.74
VDET: length 33.7
  Top Layer w0.254: 14.45,19.16 15.47,19.16 15.72,19.41 v1(15.72,25.29)
  Top Layer w0.381: v1(9.09,26.03) 8.33,26.03 7.24,24.94 7.24,22.87 6.54,22.16 4.83,22.16 3.03,20.36 3.03,14.98 2.59,14.54 2.58,13.47
  Top Layer w0.508: 3.21,12.07 3.21,10.88 3.2,10.87 ; 3.2,12.12 2.58,12.75 2.58,13.47
  Bottom Layer w0.381: v1(9.09,26.03) 9.11,26.05 14.97,26.05 v1(15.72,25.29)
$1N1611: length 4.9
  Top Layer w0.254: C25.2 9.15,22.9 10.23,21.82 11.85,21.82 12.21,21.47 12.21,20.91
$1N1640: length 3.6
  Top Layer w0.381: D1.1 3.31,9.54 4.12,10.35 R1.2
  Top Layer w0.508: R1.2 4.14,10.83 R11.1
$1N1645: length 4.1
  Top Layer w0.381: R4.2 6.12,12.2 6.12,12.42 5.59,12.95 C10.2
  Top Layer w0.508: C10.2 5.59,14.63 C11.2 ; R11.2 R4.2
$1N1648: length 3.1
  Top Layer w0.254: U17.13 8.39,18.17 7.25,17.03 R19.2
$1N1649: length 3
  Top Layer w0.254: U17.16 8.02,16.67 7.25,15.89 R20.2
$1N1650: length 7.8
  Top Layer w0.254: 5.74,17.01 5.71,17.04 v1(4.94,17.04)
  Bottom Layer w0.254: v1(4.35,23.78) 4.94,23.19 v1(4.94,17.04)
$1N1651: length 10.5
  Top Layer w0.254: R20.1 5.77,15.86 v1(5.03,15.86)
  Bottom Layer w0.254: 4.32,24.78 5.59,23.51 5.59,16.37 5.09,15.86 v1(5.03,15.86)
  vias: v1(4.32,24.78)
$1N1655: length 2.8
  Top Layer w0.254: U17.12 7.86,18.66 7.37,18.17 R7.1
$1N1658: length 4.3
  Top Layer w0.254: 6.39,20.71 6.46,20.65 U12.2 6.69,19.17 U17.11
$1N6577: length 1.6
  Top Layer w0.381: 16.77,11.75 arc(16.1,11.36) 15.33,11.35
$1N6953: length 1.8
  Top Layer w0.381: C38.1 arc(9.04,11.52) R15.2

## Copper pours and planes (outline as drawn; the poured copper is in the pictures)
GND on Top Layer: -1.35,42.99 26.22,42.99 26.22,-1.14 -1.35,-1.14
GND on Bottom Layer: -1.36,35.66 28.2,35.66 28.2,-1.26 -1.36,-1.26
PGND on Top Layer: 14.83,22.95 23.46,22.95 23.46,12.28 14.83,12.28
PGND on Top Layer: 9.08,14.3 10.47,14.3 10.47,12.79 9.08,12.79
PGND on Top Layer: 10.29,24.13 12.3,24.13 12.3,22.25 10.29,22.25
PGND on Bottom Layer: 9.12,23.66 23.47,23.66 23.47,12.5 9.12,12.5
VBUS on Top Layer: 9.62,28.54 20.51,28.54 20.51,17.03 9.62,17.03
LX1 on Top Layer: 4.49,15.65 13.6,15.65 13.6,8.11 4.49,8.11
LX2 on Top Layer: 12.56,15.66 21.7,15.66 21.7,0.46 12.56,0.46
LX2 on Bottom Layer: 14.36,9.03 14.36,8.65 18.04,8.65 18.17,8.77 18.17,9.03 18.04,9.16 14.48,9.16
LX2 on Bottom Layer: 14.52,7.32 21.7,7.32 21.7,0.46 14.52,0.46
PAD1 on Top Layer: 2.83,7.35 13.79,7.35 13.79,0.46 2.83,0.46
PAD1 on Bottom Layer: 2.82,7.33 13.78,7.33 13.78,0.46 2.82,0.46
$1N16061 on Top Layer: 13.56,15.64 14.71,15.64 14.71,12.41 13.56,12.41
$1N16063 on Top Layer: 10.17,15.59 11.35,15.59 11.35,12.42 10.17,12.42

Small or netless copper shapes (teardrops, artwork), in the pictures only: 42 on Top Layer, 16 on Bottom Layer

## Text on the board
Bottom Silkscreen Layer: PGND | GND | Caution Hot | Hardware Design / By lpp@lpp.moe
Top Silkscreen Layer: JLCJLCJLCJLC
